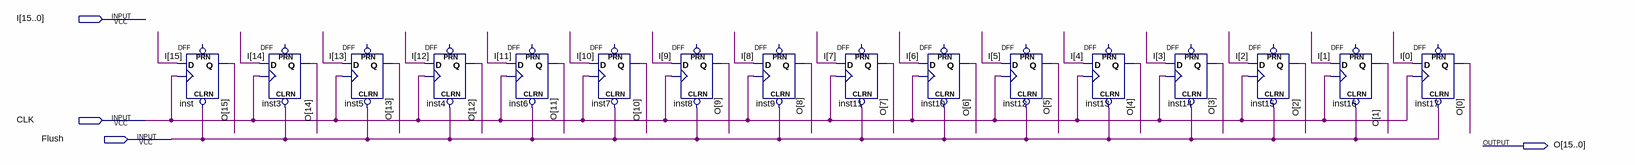
[diagram p0: schematic sheet]
// Quartus schematic IDReg.bdf as structural Verilog: 16 symbols, 4 pins
module IDReg (
  input  [15:0] I,
  input  CLK,
  input  Flush,
  output [15:0] O
);

  DFF inst (.CLRN(Flush), .CLK(CLK), .D(I[15]), .Q(O[15]));  // open: PRN
  DFF inst3 (.CLRN(Flush), .CLK(CLK), .D(I[14]), .Q(O[14]));  // open: PRN
  DFF inst5 (.CLRN(Flush), .CLK(CLK), .D(I[13]), .Q(O[13]));  // open: PRN
  DFF inst4 (.CLRN(Flush), .CLK(CLK), .D(I[12]), .Q(O[12]));  // open: PRN
  DFF inst6 (.CLRN(Flush), .CLK(CLK), .D(I[11]), .Q(O[11]));  // open: PRN
  DFF inst7 (.CLRN(Flush), .CLK(CLK), .D(I[10]), .Q(O[10]));  // open: PRN
  DFF inst8 (.CLRN(Flush), .CLK(CLK), .D(I[9]), .Q(O[9]));  // open: PRN
  DFF inst9 (.CLRN(Flush), .CLK(CLK), .D(I[8]), .Q(O[8]));  // open: PRN
  DFF inst11 (.CLRN(Flush), .CLK(CLK), .D(I[7]), .Q(O[7]));  // open: PRN
  DFF inst10 (.CLRN(Flush), .CLK(CLK), .D(I[6]), .Q(O[6]));  // open: PRN
  DFF inst12 (.CLRN(Flush), .CLK(CLK), .D(I[5]), .Q(O[5]));  // open: PRN
  DFF inst13 (.CLRN(Flush), .CLK(CLK), .D(I[4]), .Q(O[4]));  // open: PRN
  DFF inst14 (.CLRN(Flush), .CLK(CLK), .D(I[3]), .Q(O[3]));  // open: PRN
  DFF inst15 (.CLRN(Flush), .CLK(CLK), .D(I[2]), .Q(O[2]));  // open: PRN
  DFF inst16 (.CLRN(Flush), .CLK(CLK), .D(I[1]), .Q(O[1]));  // open: PRN
  DFF inst17 (.CLRN(Flush), .CLK(CLK), .D(I[0]), .Q(O[0]));  // open: PRN
endmodule
